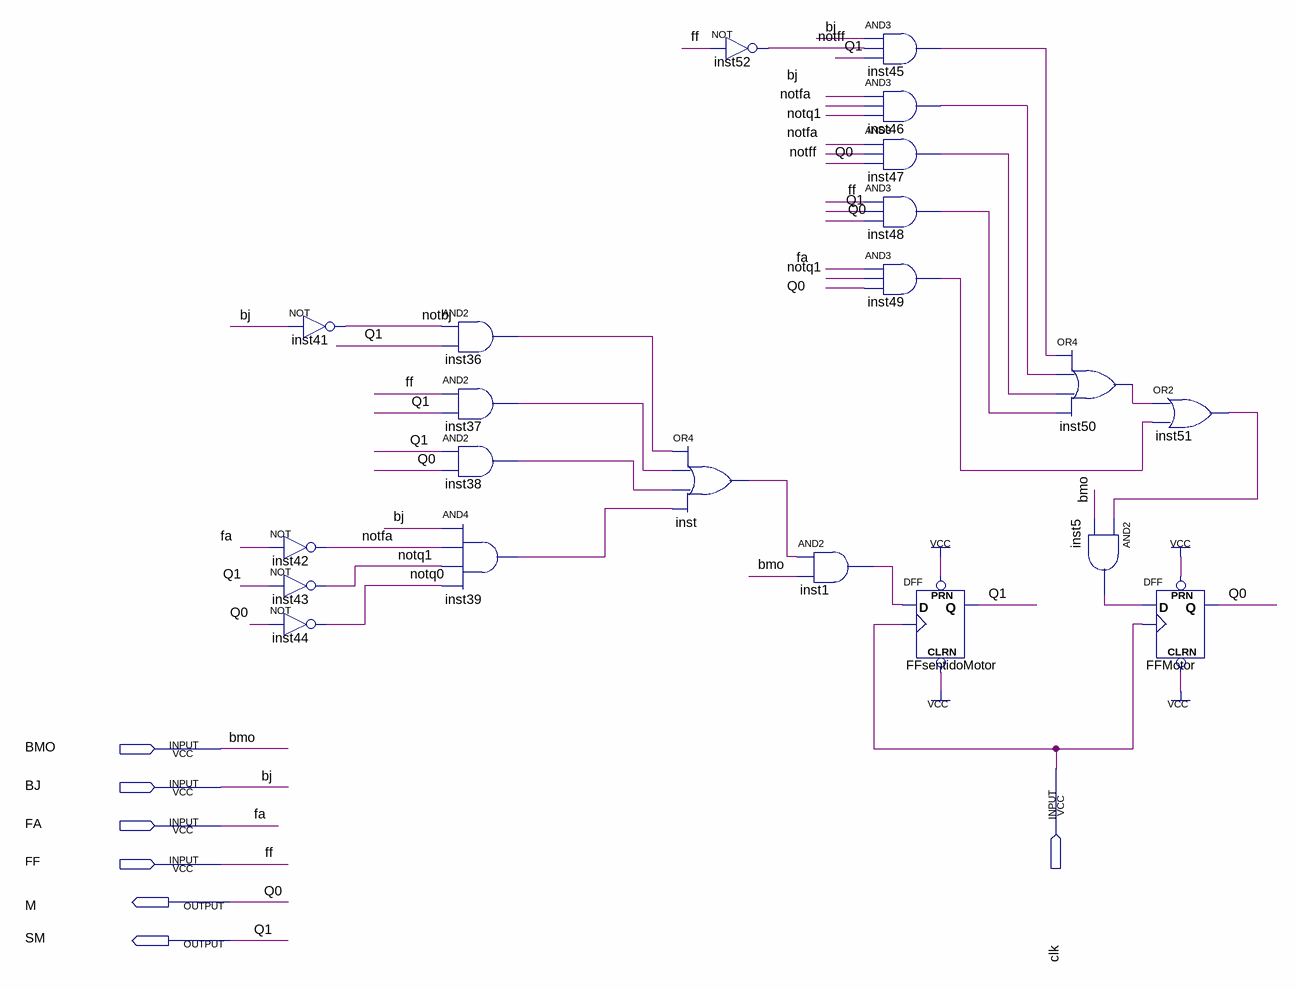
[diagram p0: schematic sheet]
// Quartus schematic controleManual.bdf as structural Verilog: 21 symbols, 7 pins
module controleManual (
  input  BMO,
  input  clk,
  input  BJ,
  input  FA,
  input  FF,
  output M,
  output SM
);

  wire inst1_out, inst5_out, inst36_out, inst37_out, inst38_out, inst39_out, inst45_out, inst46_out,
       inst47_out, inst48_out, inst49_out, inst50_out, inst51_out, inst_out, notbj, notfa, notff, notq0,
       notq1;

  not inst41 (notbj, BJ);
  not inst42 (notfa, FA);
  not inst43 (notq1, SM);
  not inst44 (notq0, M);
  and inst36 (inst36_out, notbj, SM);
  and inst37 (inst37_out, FF, SM);
  and inst38 (inst38_out, SM, M);
  and inst39 (inst39_out, BJ, notfa, notq1, notq0);
  or inst (inst_out, inst36_out, inst37_out, inst38_out, inst39_out);
  not inst52 (notff, FF);
  and inst1 (inst1_out, inst_out, BMO);
  and inst45 (inst45_out, BJ, notff, SM);
  and inst46 (inst46_out, BJ, notfa, notq1);
  and inst47 (inst47_out, notfa, notff, M);
  and inst48 (inst48_out, FF, SM, M);
  and inst49 (inst49_out, FA, notq1, M);
  DFF FFsentidoMotor (.CLRN(1'b1), .CLK(clk), .D(inst1_out), .PRN(1'b1), .Q(SM));
  or inst50 (inst50_out, inst45_out, inst46_out, inst47_out, inst48_out);
  and inst5 (inst5_out, inst51_out, BMO);
  or inst51 (inst51_out, inst50_out, inst49_out);
  DFF FFMotor (.CLRN(1'b1), .CLK(clk), .D(inst5_out), .PRN(1'b1), .Q(M));

  // Other names for the same wires on the sheet: Q0 = M; Q1 = SM
endmodule
